# Altium schematic sheet EEU.SchDoc
size A3
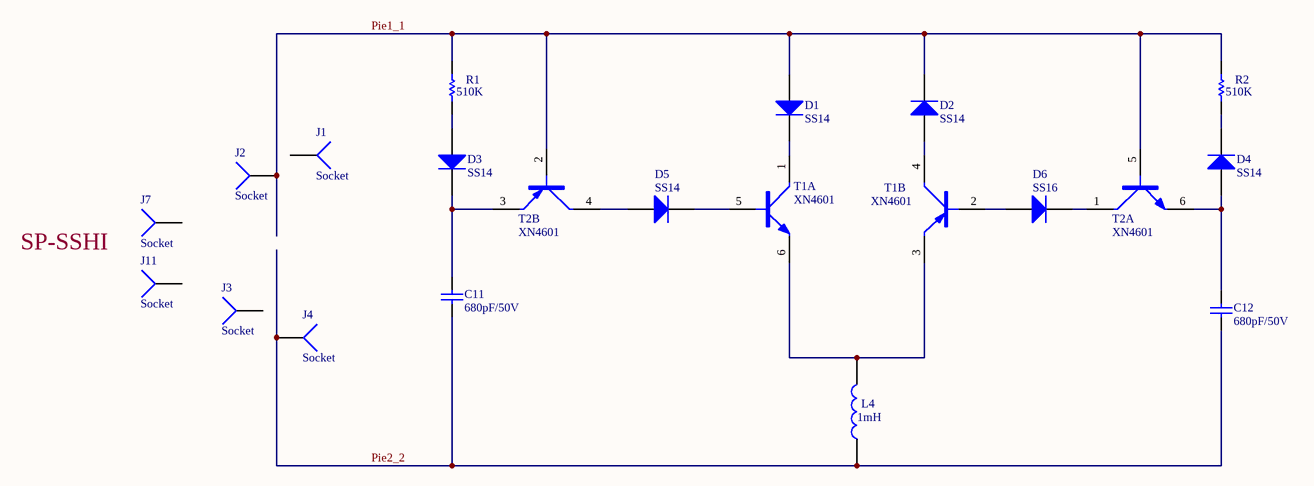
[diagram p0: EEU.SchDoc]

## Parts
C11  680pF/50V  [0603C]
C12  680pF/50V  [0603C]
D1  SS14  [SOD323]
D2  SS14  [SOD323]
D3  SS14  [SOD323]
D4  SS14  [SOD323]
D5  SS14  [SOD323]
D6  SS16  [SOD323]
J1  Socket  [PIN1]
J2  Socket  [PIN1]
J3  Socket  [PIN1]
J4  Socket  [PIN1]
J7  Socket  [PIN1]
J11  Socket  [PIN1]
L4  1mH  [1812]
R1  510K  [0603]
R2  510K  [0603]
T1  XN4601  [XN4601]  (parts A,B of 2)
T2  XN4601  [XN4601]  (parts A,B of 2)

## Nets
Pie1_1: D1.1(A) D2.2(K) J2.1 R1.2 R2.2 T2.2(PNP_B) T2.5(NPN_B)
Pie2_2: C11.1 C12.1 J4.1 L4.1
NetC11_2: C11.2 D3.2(K) T2.3(PNP_E)
NetC12_2: C12.2 D4.1(A) T2.6(NPN_E)
NetD1_2: D1.2(K) T1.1(NPN_C)
NetD2_1: D2.1(A) T1.4(PNP_C)
NetD3_1: D3.1(A) R1.1
NetD4_2: D4.2(K) R2.1
NetD5_1: D5.1(A) T2.4(PNP_C)
NetD5_2: D5.2(K) T1.5(NPN_B)
NetD6_1: D6.1(A) T1.2(PNP_B)
NetD6_2: D6.2(K) T2.1(NPN_C)
NetL4_2: L4.2 T1.3(PNP_E) T1.6(NPN_E)

Not connected (* = marked no-connect by the designer): J1 1; J3 1; J7 1; J11 1

## Notes on the sheet
- SP-SSHI

## Library data of the parts
C11 C12 = CAP: 贴片电容
D1-D6 = Diode 1N4004: 1 Amp General Purpose Rectifier; Published: 8-Jun-2000; LatestRevisionDate: 17-Jul-2002; LatestRevisionNote: Re-released for DXP Platform.; DatasheetDocument: 1998; PackageDocument: Aug-1999; PackageReference: DO-41; Publisher: Altium Limited; Code_JEDEC: DO-204-AL; ComponentLink1Description: Manufacturer Link; ComponentLink1URL: http://www.fairchildsemi.com/; ComponentLink2Description: Datasheet; ComponentLink2URL: http://www.fairchildsemi.com/ds/1N%2F1N4001.pdf
L4 = INDUCTOR
R1 R2 = Res1: 贴片电阻
T1 = XN4601: Composite Transistors
J1-J4 J7 J11 = Socket: LatestRevisionDate: 17-Jul-2002; LatestRevisionNote: Re-released for DXP Platform.; Publisher: Altium Limited